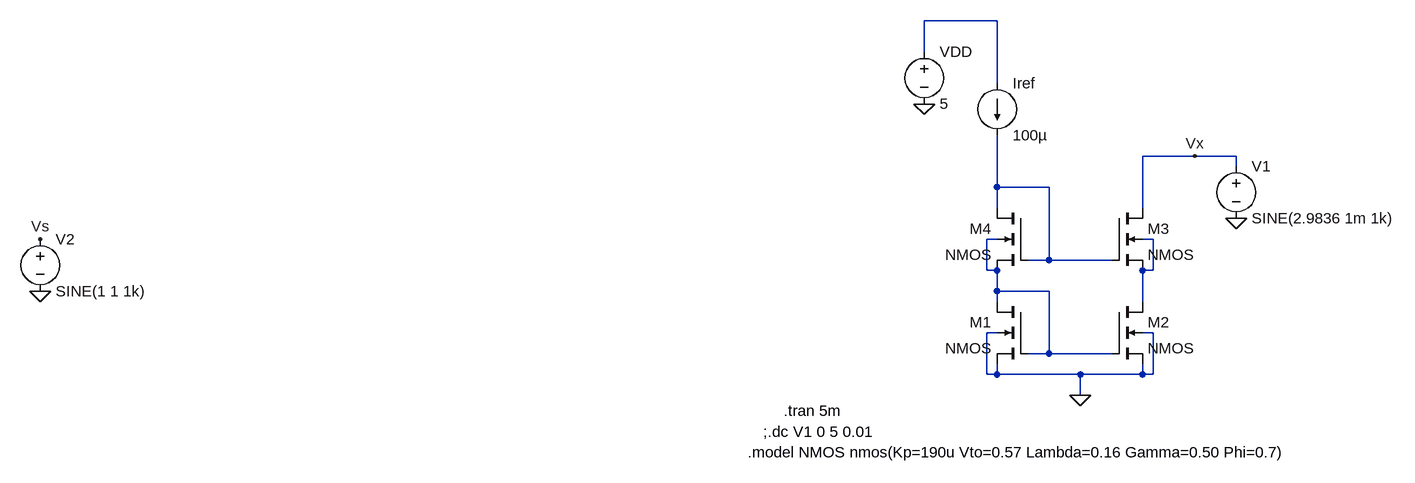
[diagram p0: schematic Cascode_current_source.asc]
Cascode_current_source.asc, the LTspice schematic file:
Version 4
SHEET 1 880 680
WIRE 64 -528 -48 -528
WIRE -48 -480 -48 -528
WIRE 64 -432 64 -528
WIRE 368 -320 288 -320
WIRE 432 -320 368 -320
WIRE 432 -304 432 -320
WIRE 64 -272 64 -352
WIRE 144 -272 64 -272
WIRE 64 -240 64 -272
WIRE 288 -240 288 -320
WIRE 64 -192 48 -192
WIRE 304 -192 288 -192
WIRE 144 -160 144 -272
WIRE 144 -160 112 -160
WIRE 240 -160 144 -160
WIRE 48 -144 48 -192
WIRE 64 -144 48 -144
WIRE 304 -144 304 -192
WIRE 304 -144 288 -144
WIRE 64 -112 64 -144
WIRE 144 -112 64 -112
WIRE 64 -96 64 -112
WIRE 288 -96 288 -144
WIRE 64 -48 48 -48
WIRE 304 -48 288 -48
WIRE 144 -16 144 -112
WIRE 144 -16 112 -16
WIRE 240 -16 144 -16
WIRE 48 16 48 -48
WIRE 64 16 64 0
WIRE 64 16 48 16
WIRE 192 16 64 16
WIRE 288 16 288 0
WIRE 288 16 192 16
WIRE 304 16 304 -48
WIRE 304 16 288 16
WIRE 192 48 192 16
FLAG 192 48 0
FLAG -48 -400 0
FLAG 432 -224 0
FLAG 368 -320 Vx
FLAG -1408 -112 0
FLAG -1408 -192 Vs
SYMBOL nmos4 112 -96 M0
SYMATTR InstName M1
SYMBOL nmos4 240 -96 R0
SYMATTR InstName M2
SYMBOL nmos4 240 -240 R0
SYMATTR InstName M3
SYMBOL nmos4 112 -240 M0
SYMATTR InstName M4
SYMBOL voltage -48 -496 R0
SYMATTR InstName VDD
SYMATTR Value 5
SYMBOL voltage 432 -320 R0
WINDOW 123 0 0 Left 0
WINDOW 39 0 0 Left 0
SYMATTR InstName V1
SYMATTR Value SINE(2.9836 1m 1k)
SYMBOL current 64 -432 R0
WINDOW 123 0 0 Left 0
WINDOW 39 0 0 Left 0
SYMATTR InstName Iref
SYMATTR Value 100µ
SYMBOL voltage -1408 -208 R0
WINDOW 123 0 0 Left 0
WINDOW 39 0 0 Left 0
SYMATTR InstName V2
SYMATTR Value SINE(1 1 1k)
TEXT -320 136 Left 2 !.model NMOS nmos(Kp=190u Vto=0.57 Lambda=0.16 Gamma=0.50 Phi=0.7)
TEXT -296 104 Left 2 !;.dc V1 0 5 0.01
TEXT -264 72 Left 2 !.tran 5m

The netlist it stands for:
* Cascode_current_source.asc
M1 N003 N003 0 0 NMOS
M2 N004 N003 0 0 NMOS
M3 Vx N002 N004 N004 NMOS
M4 N002 N002 N003 N003 NMOS
VDD N001 0 5
V1 Vx 0 SINE(2.9836 1m 1k)
Iref N001 N002 100µ
V2 Vs 0 SINE(1 1 1k)
.model NMOS NMOS
.model PMOS PMOS
.lib standard.mos
.model NMOS nmos(Kp=190u Vto=0.57 Lambda=0.16 Gamma=0.50 Phi=0.7)
;.dc V1 0 5 0.01
.tran 5m
.backanno
.end